# EAGLE design Adafruit 2.4in TFT FeatherWing (EAGLE 6.6.0)
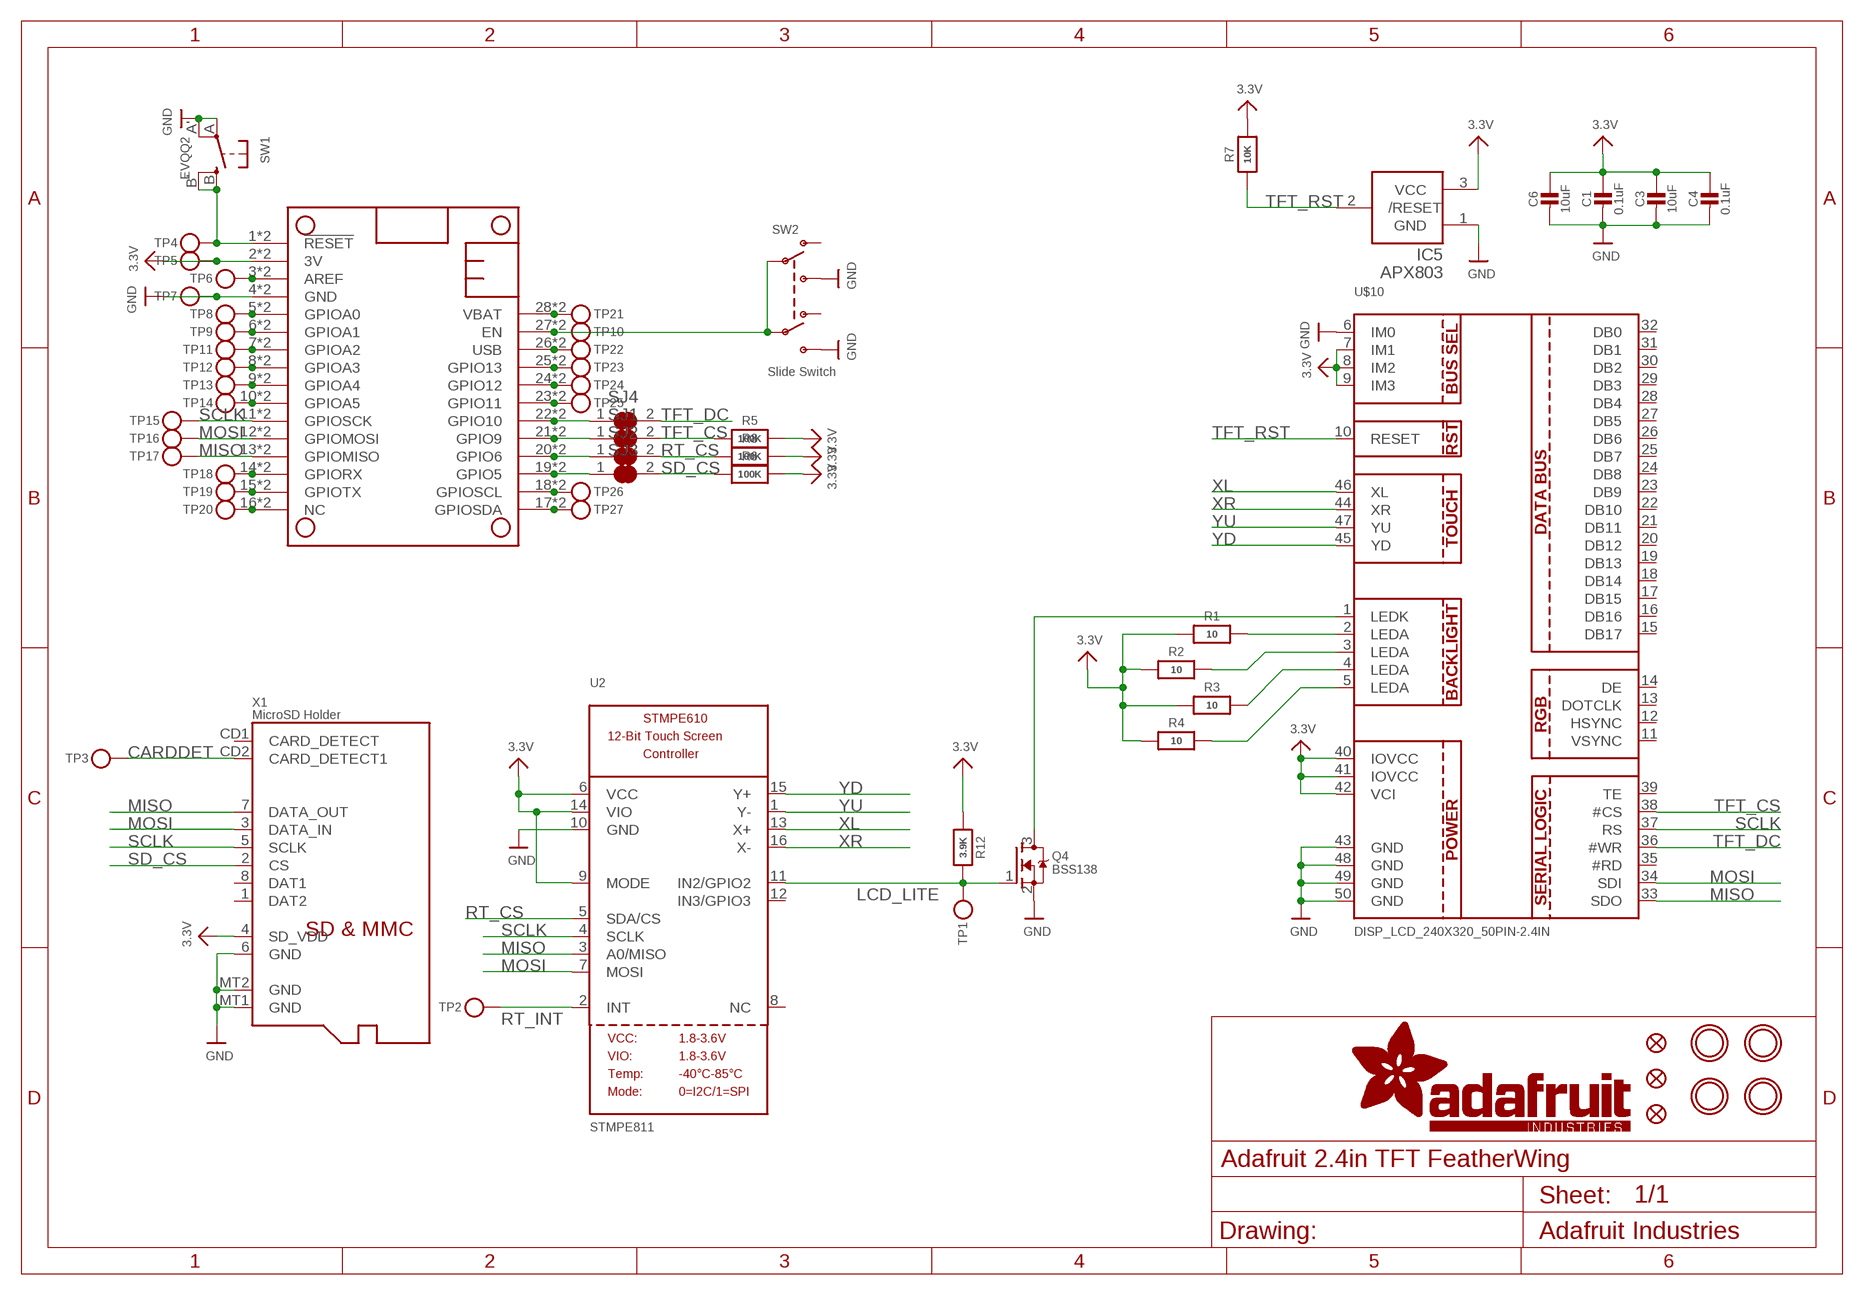
[diagram p0: schematic, sheet 1]

## Parts
C1  0.1uF  CAP_CERAMIC0805-NOOUTLINE  [0805-NO]
C3  10uF  CAP_CERAMIC0805-NOOUTLINE  [0805-NO]
C4  0.1uF  CAP_CERAMIC0805-NOOUTLINE  [0805-NO]
C6  10uF  CAP_CERAMIC0805-NOOUTLINE  [0805-NO]
FID1  FIDUCIAL""  [FIDUCIAL_1MM]
FID2  FIDUCIAL""  [FIDUCIAL_1MM]
FID3  FIDUCIAL""  [FIDUCIAL_1MM]
IC5  APX803  AXP083-SAG  [SOT23]
MS2  FEATHERWING_SMTDUAL  [FEATHERWING_SMT2]
Q4  BSS138  MOSFET-NWIDE  [SOT23-WIDE]
R1  10  RESISTOR0805_NOOUTLINE  [0805-NO]
R2  10  RESISTOR0805_NOOUTLINE  [0805-NO]
R3  10  RESISTOR0805_NOOUTLINE  [0805-NO]
R4  10  RESISTOR0805_NOOUTLINE  [0805-NO]
R5  100K  RESISTOR0805_NOOUTLINE  [0805-NO]
R6  100K  RESISTOR0805_NOOUTLINE  [0805-NO]
R7  10K  RESISTOR0805_NOOUTLINE  [0805-NO]
R8  100K  RESISTOR0805_NOOUTLINE  [0805-NO]
R12  3.9K  RESISTOR0805_NOOUTLINE  [0805-NO]
SJ1  SOLDERJUMPER_CLOSED  [SOLDERJUMPER_CLOSEDWIRE]
SJ2  SOLDERJUMPER_CLOSED  [SOLDERJUMPER_CLOSEDWIRE]
SJ3  SOLDERJUMPER_CLOSED  [SOLDERJUMPER_CLOSEDWIRE]
SJ4  SOLDERJUMPER_CLOSED  [SOLDERJUMPER_CLOSEDWIRE]
SW1  EVQQ2  SWITCH_TACT_SMT_EVQQ2_SMALL  [EVQ-Q2_SMALLER]
SW2  Slide Switch  SWITCH_DPDTEG1390  [EG1390]
TP1  TESTPOINTPAD2MM  [TESTPOINT_PAD_2MM]
TP2  TESTPOINTPAD2MM  [TESTPOINT_PAD_2MM]
TP3  TESTPOINTPAD2MM  [TESTPOINT_PAD_2MM]
TP4  TESTPOINTPAD2MM  [TESTPOINT_PAD_2MM]
TP5  TESTPOINTPAD2MM  [TESTPOINT_PAD_2MM]
TP6  TESTPOINTPAD2MM  [TESTPOINT_PAD_2MM]
TP7  TESTPOINTPAD2MM  [TESTPOINT_PAD_2MM]
TP8  TESTPOINTPAD2MM  [TESTPOINT_PAD_2MM]
TP9  TESTPOINTPAD2MM  [TESTPOINT_PAD_2MM]
TP10  TESTPOINTPAD2MM  [TESTPOINT_PAD_2MM]
TP11  TESTPOINTPAD2MM  [TESTPOINT_PAD_2MM]
TP12  TESTPOINTPAD2MM  [TESTPOINT_PAD_2MM]
TP13  TESTPOINTPAD2MM  [TESTPOINT_PAD_2MM]
TP14  TESTPOINTPAD2MM  [TESTPOINT_PAD_2MM]
TP15  TESTPOINTPAD2MM  [TESTPOINT_PAD_2MM]
TP16  TESTPOINTPAD2MM  [TESTPOINT_PAD_2MM]
TP17  TESTPOINTPAD2MM  [TESTPOINT_PAD_2MM]
TP18  TESTPOINTPAD2MM  [TESTPOINT_PAD_2MM]
TP19  TESTPOINTPAD2MM  [TESTPOINT_PAD_2MM]
TP20  TESTPOINTPAD2MM  [TESTPOINT_PAD_2MM]
TP21  TESTPOINTPAD2MM  [TESTPOINT_PAD_2MM]
TP22  TESTPOINTPAD2MM  [TESTPOINT_PAD_2MM]
TP23  TESTPOINTPAD2MM  [TESTPOINT_PAD_2MM]
TP24  TESTPOINTPAD2MM  [TESTPOINT_PAD_2MM]
TP25  TESTPOINTPAD2MM  [TESTPOINT_PAD_2MM]
TP26  TESTPOINTPAD2MM  [TESTPOINT_PAD_2MM]
TP27  TESTPOINTPAD2MM  [TESTPOINT_PAD_2MM]
U2  STMPE811  STMPE610  [QFN16_3MM]
U$9  MOUNTINGHOLE2.5  [MOUNTINGHOLE_2.5_PLATED]
U$10  DISP_LCD_240X320_50PIN-2.4IN  [TFT_2.4IN_240X320_50PIN]
U$11  MOUNTINGHOLE2.5  [MOUNTINGHOLE_2.5_PLATED]
U$15  MOUNTINGHOLE2.5  [MOUNTINGHOLE_2.5_PLATED]
U$17  MOUNTINGHOLE2.5  [MOUNTINGHOLE_2.5_PLATED]
X1  MicroSD Holder  MICROSD  [MICROSD]

## Nets
3.3V: C1.1 C3.1 C4.1 C6.1 IC5.3(VCC) MS2.2'(3V) MS2.2(3V) R1.1 R2.1 R3.1 R4.1 R5.2 R6.2 R7.2 R8.2 R12.1 TP5.P$1 U2.6(VCC) U2.9(MODE) U2.14(VIO) U$10.7(IM1) U$10.8(IM2) U$10.9(IM3) U$10.40(IOVCC) U$10.41(IOVCC) U$10.42(VCI) X1.4(SD_VDD)
!RESET: MS2.1'(!RESET) MS2.1(!RESET) SW1.B'(S1) SW1.B(S) TP4.P$1
A: MS2.5'(GPIOA0) MS2.5(GPIOA0) TP8.P$1
AREF: MS2.3'(AREF) MS2.3(AREF) TP6.P$1
B: MS2.6'(GPIOA1) MS2.6(GPIOA1) TP9.P$1
C: MS2.7'(GPIOA2) MS2.7(GPIOA2) TP11.P$1
CARDDET: TP3.P$1 X1.CD2(CARD_DETECT1)
D: MS2.8'(GPIOA3) MS2.8(GPIOA3) TP12.P$1
E: MS2.9'(GPIOA4) MS2.9(GPIOA4) TP13.P$1
EN: MS2.27'(EN) MS2.27(EN) SW2.P1 SW2.P2 TP10.P$1
F: MS2.10'(GPIOA5) MS2.10(GPIOA5) TP14.P$1
G: MS2.16'(NC) MS2.16(NC) TP20.P$1
GND: C1.2 C3.2 C4.2 C6.2 IC5.1(GND) MS2.4'(GND) MS2.4(GND) Q4.2(S) SW1.A'(P1) SW1.A(P) SW2.S1 SW2.S2 TP7.P$1 U2.10(GND) U$10.6(IM0) U$10.43(GND) U$10.48(GND) U$10.49(GND) U$10.50(GND) X1.6(GND) X1.MT1(GND) X1.MT2(GND)
H: MS2.19'(GPIO5) MS2.19(GPIO5) SJ3.1
I: MS2.20'(GPIO6) MS2.20(GPIO6) SJ2.1
J: MS2.21'(GPIO9) MS2.21(GPIO9) SJ1.1
K: MS2.22'(GPIO10) MS2.22(GPIO10) SJ4.1
L: MS2.23'(GPIO11) MS2.23(GPIO11) TP25.P$1
LCD_LITE: Q4.1(G) R12.2 TP1.P$1 U2.11(IN2/GPIO2)
M: MS2.24'(GPIO12) MS2.24(GPIO12) TP24.P$1
MISO: MS2.13'(GPIOMISO) MS2.13(GPIOMISO) TP17.P$1 U2.3(A0/MISO) U$10.33(SDO) X1.7(DATA_OUT)
MOSI: MS2.12'(GPIOMOSI) MS2.12(GPIOMOSI) TP16.P$1 U2.7(MOSI) U$10.34(SDI) X1.3(DATA_IN)
N: MS2.25'(GPIO13) MS2.25(GPIO13) TP23.P$1
N$1: R4.2 U$10.5(LEDA)
N$2: R1.2 U$10.2(LEDA)
N$3: R2.2 U$10.3(LEDA)
N$4: R3.2 U$10.4(LEDA)
N$5: Q4.3(D) U$10.1(LEDK)
RT_CS: R8.1 SJ2.2 U2.5(SDA/CS)
RT_INT: TP2.P$1 U2.2(INT)
RX: MS2.14'(GPIORX) MS2.14(GPIORX) TP18.P$1
SCL: MS2.18'(GPIOSCL) MS2.18(GPIOSCL) TP26.P$1
SCLK: MS2.11'(GPIOSCK) MS2.11(GPIOSCK) TP15.P$1 U2.4(SCLK) U$10.37(RS) X1.5(SCLK)
SD_CS: R6.1 SJ3.2 X1.2(CS)
SDA: MS2.17'(GPIOSDA) MS2.17(GPIOSDA) TP27.P$1
TFT_CS: R5.1 SJ1.2 U$10.38(#CS)
TFT_DC: SJ4.2 U$10.36(#WR)
TFT_RST: IC5.2(/RESET) R7.1 U$10.10(RESET)
TX: MS2.15'(GPIOTX) MS2.15(GPIOTX) TP19.P$1
USB: MS2.26'(USB) MS2.26(USB) TP22.P$1
VBAT: MS2.28'(VBAT) MS2.28(VBAT) TP21.P$1
XL: U2.13(X+) U$10.46(XL)
XR: U2.16(X-) U$10.44(XR)
YD: U2.15(Y+) U$10.45(YD)
YU: U2.1(Y-) U$10.47(YU)
Unconnected: SW2.O1 SW2.O2 U2.8(NC) U2.12(IN3/GPIO3) U$10.11(VSYNC) U$10.12(HSYNC) U$10.13(DOTCLK) U$10.14(DE) U$10.15(DB17) U$10.16(DB16) U$10.17(DB15) U$10.18(DB14) U$10.19(DB13) U$10.20(DB12) U$10.21(DB11) U$10.22(DB10) U$10.23(DB9) U$10.24(DB8) U$10.25(DB7) U$10.26(DB6) U$10.27(DB5) U$10.28(DB4) U$10.29(DB3) U$10.30(DB2) U$10.31(DB1) U$10.32(DB0) U$10.35(#RD) U$10.39(TE) X1.1(DAT2) X1.8(DAT1) X1.CD1(CARD_DETECT)

## Library data of the parts
C1 C3 C4 C6 = microbuilder:CAP_CERAMIC: Ceramic Capacitors For new designs, use the packages preceded by an '_' character since they are more reliable: The following footprints should be used on most boards: _0402 - Standard footprint for regular board layouts _0603 - Standard footprint for regular board layouts _0805 - Standard footprint for regular board layouts _1206 - Standard footprint for regular board layouts For extremely tight-pitch boards where space is at a premium, the following 'micro-pitch' footprints can be used (smaller pads, no silkscreen outline, etc.): _0402MP - Micro-pitch footprint for very dense/compact boards _0603MP - Micro-pitch footprint for very dense/compact boards _0805MP - Micro-pitch footprint for very dense/compact boards _1206MP - Micro-pitch footprint for very dense/compact boards
FID1-FID3 = microbuilder:FIDUCIAL: Fiducial Alignment Points Various fiducial points for machine vision alignment.; BOM: EXCLUDE
IC5 = adafruit:AXP083
MS2 = microbuilder:FEATHERWING
Q4 = microbuilder:MOSFET-N: N-Channel Mosfet LEGEND VDS: Voltage Drain-Source ID: Drain Current RDS(ON): Drain-Source On-State Resistance VGS(TH): Gate-Source Threshold Voltage CISS: Drain-Source Input Capacitance SOT-23 Name VDS ID RDS(ON) VGS(TH) CISS Order Number 2N7002E 60V 260mA 2.5 Ohm 2.5V @ 250uA 26.7pF @ 25V 2N7002ET1GOSTR-ND BSH103 30V 850mA 400 mOhm 400mV @ 1mA 83pF @ 24V BSH103,235-ND BSS138 60V 320mA 1.6 Ohm 1.5V @ 250uA 50pF @ 10V Mouser: 771-BSS138PW115 DMN2075U-7 20V 4.2A 38 mOhm 1V @ 250 uA 594.3pF @ 10V DMN2075U-7DICT-ND * BSS138 good choice for I2C level-shifting POWERPAK 1212-8 Name VDS ID RDS(ON) VGS(TH) CISS Order Number Si7308DN 60V 6A 58 mOhm 3V @ 250uA 665pF @ 15V SI7308DN-T1-E3CT-ND
R1-R8 R12 = microbuilder:RESISTOR: Resistors For new designs, use the packages preceded by an '_' character since they are more reliable: The following footprints should be used on most boards: _0402 - Standard footprint for regular board layouts _0603 - Standard footprint for regular board layouts _0805 - Standard footprint for regular board layouts _1206 - Standard footprint for regular board layouts For extremely tight-pitch boards where space is at a premium, the following 'micro-pitch' footprints can be used (smaller pads, no silkscreen outline, etc.): _0402MP - Micro-pitch footprint for very dense/compact boards _0603MP - Micro-pitch footprint for very dense/compact boards _0805MP - Micro-pitch footprint for very dense/compact boards _1206MP - Micro-pitch footprint for very dense/compact boards
SJ1-SJ4 = microbuilder:SOLDERJUMPER_CLOSED: Solder Jumper - Closed These solder jumpers are closed by default CLOSEDWIRE - 10 mil trace between pads that can be cut and resoldered later CLOSEDPERM - 63 mil trace between pads for a permanent connection (used to 'bridge' two signals, a shameless hack for Eagle). Can double as a test point as well (no cream layer)
SW1 = microbuilder:SWITCH_TACT_SMT: SMT Tact Switches 6x6mm - Digikey: P12940SCT-ND KMR2 (4.6x2.8mm) - Digikey: 401-1426-1-ND EVQ-PQHB55 - Light Touch, 160GF (4.5x4.5mm) - Digikey: P8090SCT-ND KMT0 - KMT021 NGJ LHS (etc.) IP68/Waterproof - Digikey: CKN10289CT-ND
SW2 = microbuilder:SWITCH_DPDT: Switch - DPDT A DPDT Switch acts like an SPDT switch, but has a pair of switches instead of just one. Vertical - 0.3A @ 6V SMT - Digikey: JS202011SCQN
TP1-TP27 = microbuilder:TESTPOINT: Test Point Various test points for characterisation and PCB testing TESTPOINT_SMT - Compact Surface Mount Test Point [Digikey: 5016KTR-ND]
U2 = microbuilder:STMPE610: STMPE610 - 12-Bit Touch Screen Controller
U$9 U$11 U$15 U$17 = microbuilder:MOUNTINGHOLE: Mounting Hole For #2 screws (0.086"/2.18mm width, 0.094"/2.4mm hole) use 2.5mm; BOM: EXCLUDE
U$10 = microbuilder:DISP_LCD_240X320_50PIN
X1 = microbuilder:MICROSD: MicroSD/Transflash Card Holder with SPI pinout 3M: 2908-05WB-MG 4UConnector: 19656 Footprint courtesy: Adafruit Industries

## Board
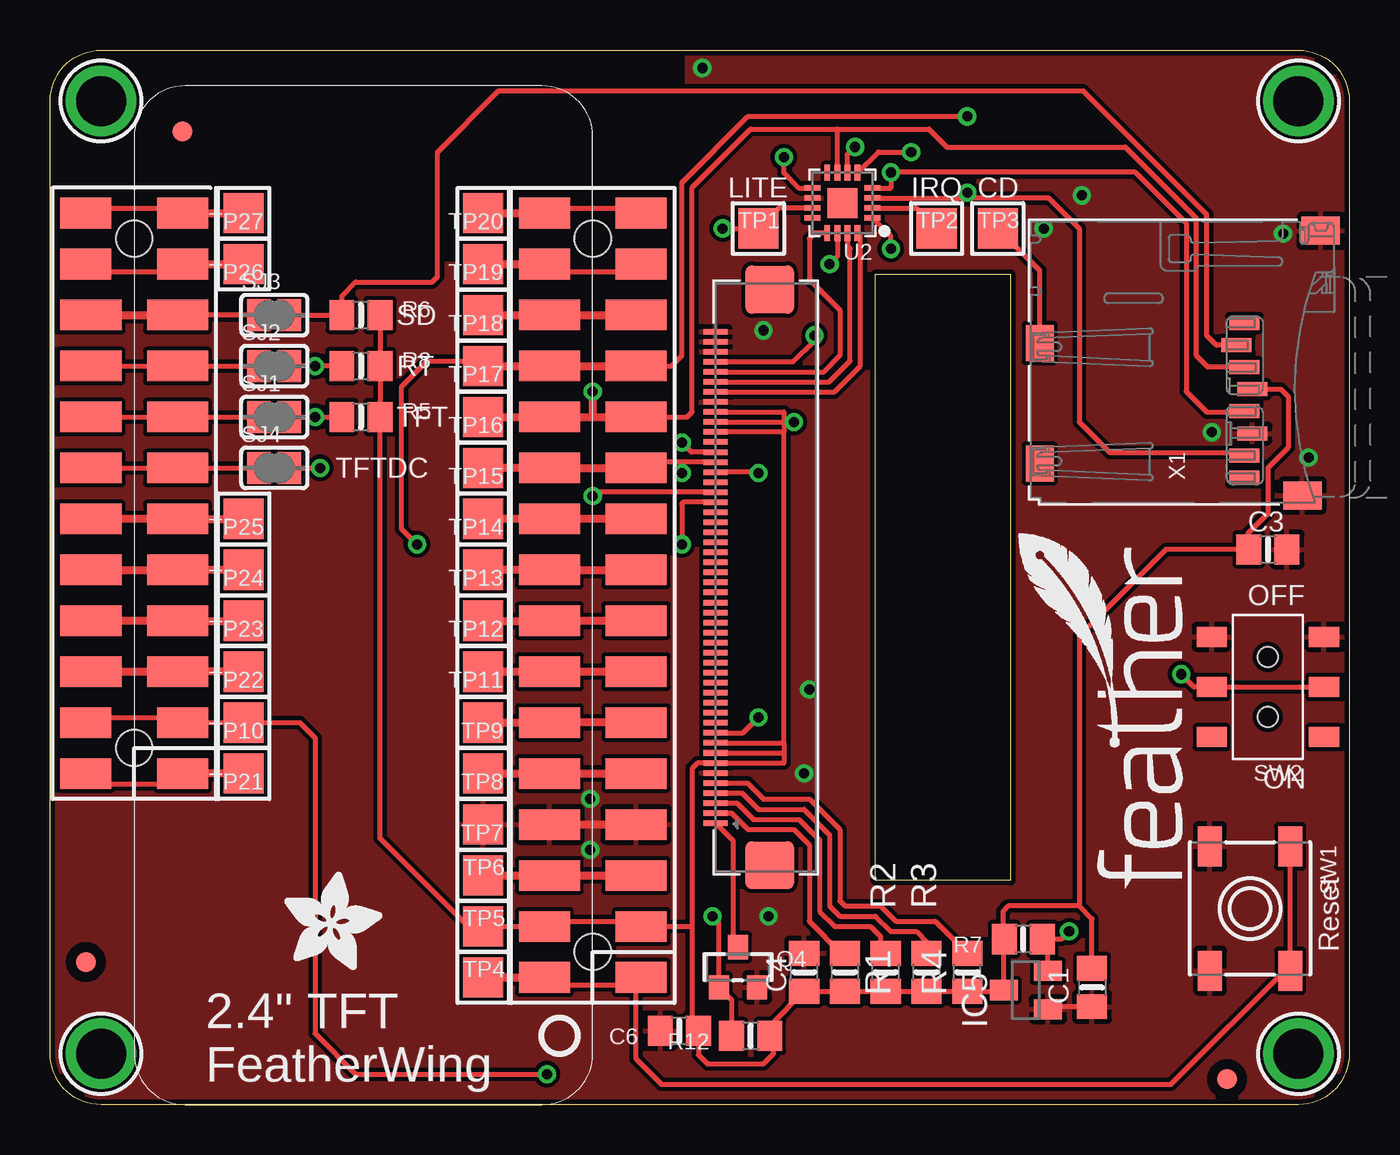
[diagram p1: board, top side]
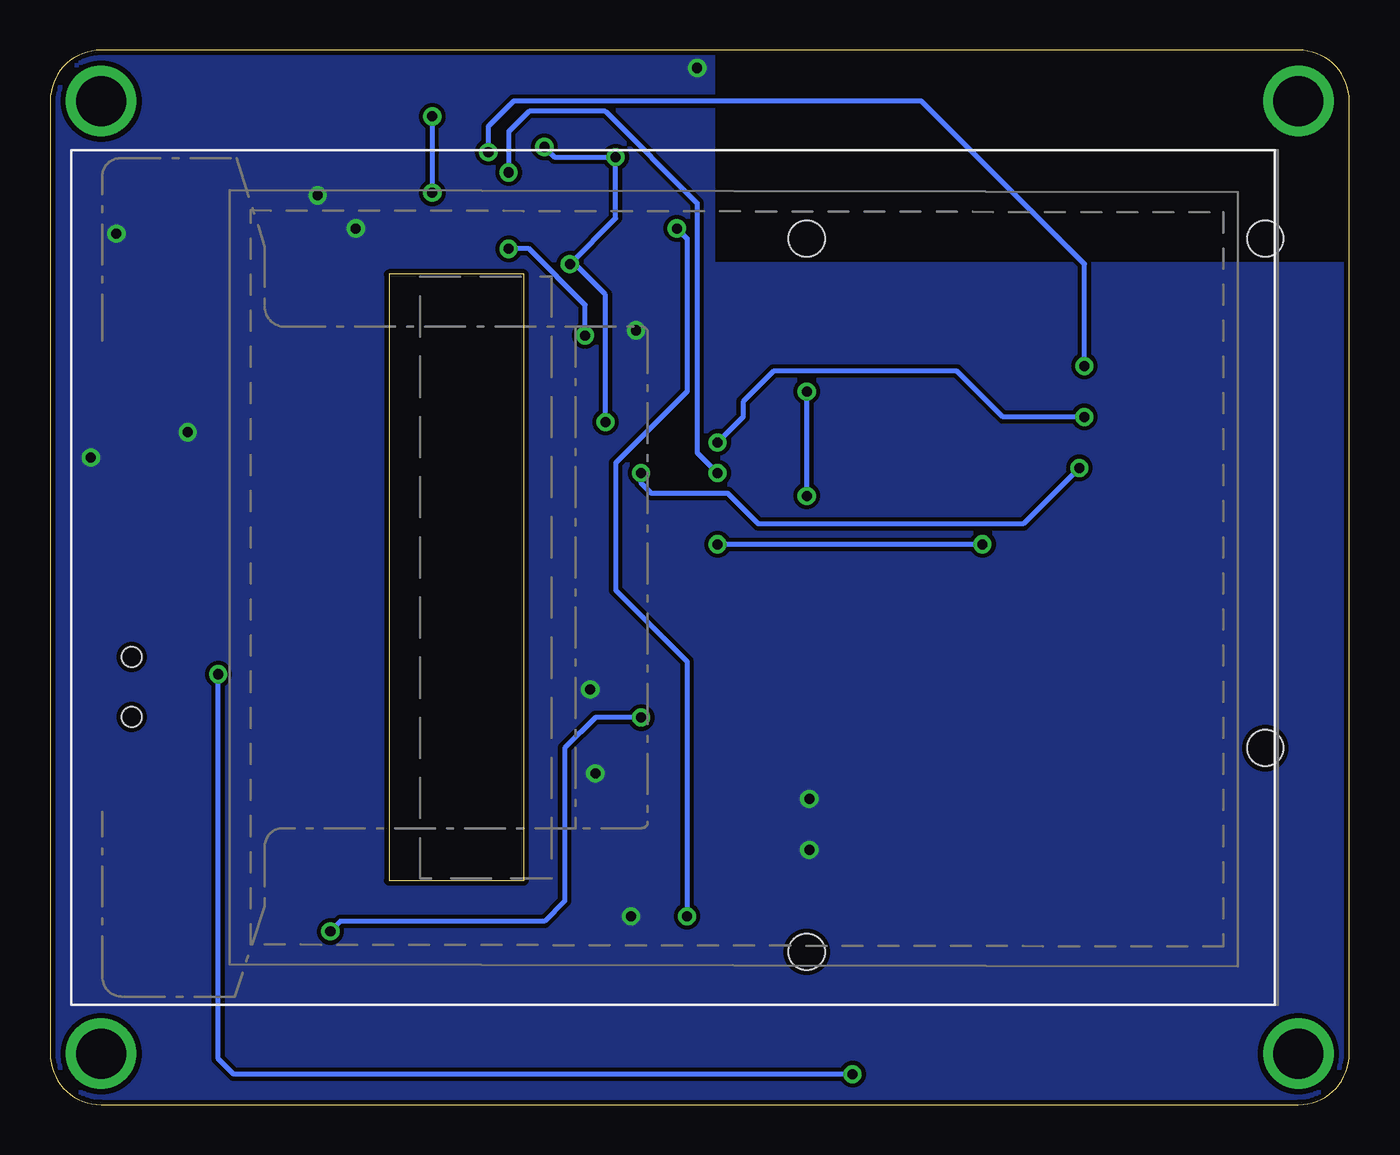
[diagram p2: board, bottom side, seen from below]

Size 64.77 x 52.58 mm. Coordinates in mm from the lower left corner, seen from the top.
Outline: 0,2.54 0,50.04 arc-90 2.54,52.58 62.23,52.58 arc-90 64.77,50.04 64.77,2.54 arc-90 62.23,0 2.54,0 arc-90 0,2.54
Outline: 41.15,11.18 41.15,41.4 47.88,41.4 47.88,11.18 41.15,11.18
Copper layers (1*16): Top 0.035mm / dielectric 1.5mm / Bottom 0.035mm
Design rules "adafruit *": minimum track width 8mil, minimum drill 15.5mil, track to track 8mil, track to pad 8mil, pad to pad 8mil, via to via 8mil, smd to smd 8mil, copper to edge 10mil, drill to drill 8mil, minimum pad ring 10mil, minimum via ring 8mil, stop-mask expansion 2mil, vias tented up to drill 20mil, thermal gap 10mil

### Footprints (pad centres in the part's own frame; a part is rotated, then mirrored left to right if it is on the bottom)
0805-NO = smd 1.24 x 1.5: 1 -0.95,0; 2 0.95,0
FIDUCIAL_1MM = smd 1 x 1: 1 0,0
SOT23 = smd 1 x 1.4: 1 -0.95,-1.1; 2 0.95,-1.1; 3 0,1.1
FEATHERWING_SMT2 = smd 1.524 x 2.54: 1 6.35,2.413; 1' 6.35,-2.413; 2 8.89,2.413; 2' 8.89,-2.413; 15 41.91,2.413; 15' 41.91,-2.413; 16 44.45,2.413; 16' 44.45,-2.413; 17 44.45,20.447; 17' 44.45,25.273; 18 41.91,20.447; 18' 41.91,25.273; 27 19.05,20.447; 27' 19.05,25.273; 28 16.51,20.447; 28' 16.51,25.273 | smd 1.524 x 3.048: 3 11.43,2.159; 3' 11.43,-2.159; 4 13.97,2.159; 4' 13.97,-2.159; 5 16.51,2.159; 5' 16.51,-2.159; 6 19.05,2.159; 6' 19.05,-2.159; 7 21.59,2.159; 7' 21.59,-2.159; 8 24.13,2.159; 8' 24.13,-2.159; 9 26.67,2.159; 9' 26.67,-2.159; 10 29.21,2.159; 10' 29.21,-2.159; 11 31.75,2.159; 11' 31.75,-2.159; 12 34.29,2.159; 12' 34.29,-2.159; 13 36.83,2.159; 13' 36.83,-2.159; 14 39.37,2.159; 14' 39.37,-2.159; 19 39.37,20.701; 19' 39.37,25.019; 20 36.83,20.701; 20' 36.83,25.019; 21 34.29,20.701; 21' 34.29,25.019; 22 31.75,20.701; 22' 31.75,25.019; 23 29.21,20.701; 23' 29.21,25.019; 24 26.67,20.701; 24' 26.67,25.019; 25 24.13,20.701; 25' 24.13,25.019; 26 21.59,20.701; 26' 21.59,25.019 | hole 1.8: 17.78,22.86; 43.18,22.86; 7.62,0; 43.18,0
SOT23-WIDE = smd 1 x 1.2: 1 -0.95,-1; 2 0.95,-1; 3 0,1
SOLDERJUMPER_CLOSEDWIRE = smd 1.168 x 1.6: 1 -0.762,0; 2 0.762,0 | smd 0.635 x 0.203: WIRE 0,0
EVQ-Q2_SMALLER = smd 2 x 1.2: A -3.1,-2; A' 3.1,-2; B -3.1,2; B' 3.1,2
EG1390 = smd 1 x 1.5: O1 -2.5,2.8; O2 -2.5,-2.8; P1 0,2.8; P2 0,-2.8; S1 2.5,2.8; S2 2.5,-2.8 | hole 1: 1.5,0; -1.5,0
TESTPOINT_PAD_2MM = smd 2 x 2: P$1 0,0
QFN16_3MM = smd 0.8 x 0.28: 1 -1.5,0.75; 2 -1.5,0.25; 3 -1.5,-0.25; 4 -1.5,-0.75; 9 1.5,-0.75; 10 1.5,-0.25; 11 1.5,0.25; 12 1.5,0.75 | smd 0.28 x 0.8: 5 -0.75,-1.5; 6 -0.25,-1.5; 7 0.25,-1.5; 8 0.75,-1.5; 13 0.75,1.5; 14 0.25,1.5; 15 -0.25,1.5; 16 -0.75,1.5 | smd 1.5 x 1.5: THERMAL 0,0
MOUNTINGHOLE_2.5_PLATED = drill 2.5 pad 3.2: P$1 0,0
TFT_2.4IN_240X320_50PIN = smd 0.275 x 1.2 bottom: 1 12.25,28.551; 2 11.75,28.551; 3 11.25,28.551; 4 10.75,28.551; 5 10.25,28.551; 6 9.75,28.551; 7 9.25,28.551; 8 8.75,28.551; 9 8.25,28.551; 10 7.75,28.551; 11 7.25,28.551; 12 6.75,28.551; 13 6.25,28.551; 14 5.75,28.551; 15 5.25,28.551; 16 4.75,28.551; 17 4.25,28.551; 18 3.75,28.551; 19 3.25,28.551; 20 2.75,28.551; 21 2.25,28.551; 22 1.75,28.551; 23 1.25,28.551; 24 0.75,28.551; 25 0.25,28.551; 26 -0.25,28.551; 27 -0.75,28.551; 28 -1.25,28.551; 29 -1.75,28.551; 30 -2.25,28.551; 31 -2.75,28.551; 32 -3.25,28.551; 33 -3.75,28.551; 34 -4.25,28.551; 35 -4.75,28.551; 36 -5.25,28.551; 37 -5.75,28.551; 38 -6.25,28.551; 39 -6.75,28.551; 40 -7.25,28.551; 41 -7.75,28.551; 42 -8.25,28.551; 43 -8.75,28.551; 44 -9.25,28.551; 45 -9.75,28.551; 46 -10.25,28.551; 47 -10.75,28.551; 48 -11.25,28.551; 49 -11.75,28.551; 50 -12.25,28.551 | smd 2.4 x 2.4 bottom: PAD1 14.35,25.851; PAD2 -14.35,25.851
MICROSD = smd 0.7 x 1.5: 1 9,-10.64; 2 7.9,-10.24; 3 6.8,-10.64; 4 5.7,-11.04; 5 4.6,-10.64; 6 3.5,-11.04; 7 2.4,-10.64; 8 1.3,-10.64 | smd 1.8 x 1.4: CD1 2,-0.44; CD2 8,-0.44 | smd 1.4 x 1.9: MT1 0.4,-13.54; MT2 13.6,-14.44

### Placement (x,y rotation side)
C1  51.94,5.84 270 top
C3  60.71,27.69 0 top
C4  37.59,6.6 90 top
C6  31.37,3.68 180 top
FID1  6.6,48.51 0 top
FID2  58.67,1.27 0 top
FID3  1.78,7.11 0 top
IC5  48.64,5.71 90 top
MS2  27.05,0 90 top
Q4  34.29,6.86 0 top
R1  39.62,6.6 90 top
R2  41.66,6.6 90 top
R3  43.69,6.6 90 top
R4  45.72,6.6 90 top
R5  15.49,34.29 0 top
R6  15.49,39.37 0 top
R7  48.51,8.26 180 top
R8  15.49,36.83 0 top
R12  34.92,3.43 180 top
SJ1  11.18,34.29 0 top
SJ2  11.18,36.83 0 top
SJ3  11.18,39.37 0 top
SJ4  11.18,31.75 0 top
SW1  59.82,9.78 270 top
SW2  60.71,20.83 90 top
TP1  35.31,43.69 0 top
TP2  44.2,43.69 0 top
TP3  47.24,43.69 0 top
TP4  21.59,6.35 0 top
TP5  21.59,8.89 0 top
TP6  21.59,11.43 0 top
TP7  21.59,13.97 180 top
TP8  21.59,16.51 180 top
TP9  21.59,19.05 180 top
TP10  9.65,19.05 180 top
TP11  21.59,21.59 180 top
TP12  21.59,24.13 180 top
TP13  21.59,26.67 180 top
TP14  21.59,29.21 180 top
TP15  21.59,31.75 180 top
TP16  21.59,34.29 180 top
TP17  21.59,36.83 180 top
TP18  21.59,39.37 180 top
TP19  21.59,41.91 180 top
TP20  21.59,44.45 180 top
TP21  9.65,16.51 180 top
TP22  9.65,21.59 180 top
TP23  9.65,24.13 180 top
TP24  9.65,26.67 180 top
TP25  9.65,29.21 180 top
TP26  9.65,41.91 180 top
TP27  9.65,44.45 180 top
U2  39.5,44.96 180 top
U$9  2.54,2.54 0 top
U$10  61.72,26.29 270 bottom
U$11  2.54,50.04 0 top
U$15  62.23,2.54 0 top
U$17  62.23,50.04 0 top
U$29  [FEATHERLOGO_MED]  56.52,10.67 90 top
U$30  [ADAFRUIT_5MM]  11.68,6.73 0 top
U$34  [PCBFEAT-REV-040]  25.4,3.43 0 top
X1  48.9,29.97 90 top

### Tracks (layer width: path | path; a pad name or v marks a point on that pad's centre or on a via)
3.3V  (via drill 0.5)
  Top 0.254: C1.1 51.94,9.27 51.31,9.91 | 51.31,9.91 47.75,9.91 47.5,9.65 47.5,8.32 R7.2 47.54,8.23 IC5.3 47.48,5.65 R4.1 R3.1 R2.1 R1.1 C4.1 35.88,3.94 R12.1 | 32,8.89 MS2.2' 28.83,8.89 28.57,9.14 24.89,9.14 MS2.2 TP5.P$1 | U$10.41 36.58,34.04 | 36.58,34.04 | 36.58,34.04 36.58,33.53 | 36.58,33.53 33.17,33.53 U$10.40 | U$10.42 36.58,34.54 36.58,34.04 | U$10.9 36.58,18.04 | 36.58,18.04 36.58,17.54 | 36.58,17.54 36.58,17.04 U$10.7 32.28,17.04 32,16.76 32,8.89 | U$10.8 36.58,17.54 | 36.58,18.04 36.58,33.53 | R6.2 R8.2 R5.2 16.44,13.27 20.83,8.89 21.08,8.89 | U2.14 39.25,42.3 v38.86,41.91 | U2.9 37.33,45.71 36.58,46.46 v36.58,47.24 | 36.58,34.04 v37.08,34.04 | 51.31,9.91 51.31,23.37 55.63,27.69 C3.1 59.69,27.75 59.69,28.45 60.71,29.46 60.71,31.75 61.72,32.77 61.72,35.31 61.36,35.67 X1.4 | U2.6 39.75,47.37 v40.13,47.75 | 35.56,3.24 35.75,3.43 R12.1 | 32,8.89 32,4 C6.1 32.32,2.48 32.77,2.03 35.56,2.03 36.07,2.54 36.07,3.24 R12.1
  Top 0.406: TP5.P$1 21.08,8.89
  Bottom 0.254: v37.08,34.04 37.08,40.39 38.61,41.91 v38.86,41.91 36.58,44.2 v36.58,47.24 39.62,47.24 v40.13,47.75
!RESET
  Top 0.254: SW1.B SW1.B' 61.82,6.95 55.88,1.02 30.48,1.02 29.21,2.29 29.21,6.1 MS2.1' 28.83,6.35 28.45,5.97 25.02,5.97 MS2.1
  Top 0.406: TP4.P$1 MS2.1
A
  Top 0.406: MS2.5' MS2.5 TP8.P$1
AREF
  Top 0.406: MS2.3' MS2.3 TP6.P$1
B
  Top 0.406: MS2.6' 25.78,19.05 25.78,18.92 24.89,18.92 MS2.6 TP9.P$1
C
  Top 0.406: MS2.7' 29.21,21.34 28.7,21.34 28.7,21.59 MS2.7 TP11.P$1
CARDDET
  Top 0.254: X1.CD2 49.34,41.6 TP3.P$1
D
  Top 0.406: MS2.8' MS2.8 TP12.P$1
E
  Top 0.406: MS2.9' 29.21,26.16 28.45,26.16 28.45,26.67 MS2.9 TP13.P$1
EN  (via drill 0.5)
  Top 0.254: SW2.P2 SW2.P1 57.02,20.83 v56.39,21.46 | TP10.P$1 MS2.27 6.1,19.05 5.84,19.3 2.03,19.3 MS2.27' | 9.91,19.05 12.45,19.05 13.21,18.29 13.21,3.56 15.24,1.52 v24.77,1.52
  Top 0.406: TP10.P$1 9.91,19.05
  Bottom 0.254: v24.77,1.52 55.63,1.52 56.39,2.29 v56.39,21.46
F
  Top 0.406: MS2.10' MS2.10 TP14.P$1
G
  Top 0.254: MS2.16 24.89,44.7 28.83,44.7 29.08,44.45 MS2.16'
  Top 0.406: TP20.P$1 MS2.16
GND  (via drill 0.5)
  Top 0.254: C1.2 49.87,4.89 IC5.1
  Top 0.406: MS2.4 MS2.4'
  other vias: 35.81,9.4 37.59,16.51 35.56,38.61 26.92,15.24 26.92,12.7 57.91,33.53 62.74,32.26 61.47,43.43 37.85,20.7 32.51,51.69 51.44,45.34 49.53,43.69
  pour Top: 0.13,41.91 0,0 64.77,0 64.77,52.58 31.75,52.58 31.75,41.91
  pour Bottom: 0,41.91 0,0 64.77,0 64.77,52.58 31.75,52.58 31.75,41.91
H
  Top 0.254: SJ3.1 MS2.19
  Top 0.406: MS2.19' MS2.19
I
  Top 0.254: MS2.20' MS2.20 SJ2.1
J
  Top 0.254: MS2.21' MS2.21 SJ1.1
K
  Top 0.254: MS2.22' MS2.22 SJ4.1
L
  Top 0.406: MS2.23' MS2.23 TP25.P$1
LCD_LITE  (via drill 0.5)
  Top 0.254: v33.02,9.4 33.34,9.08 Q4.1 33.98,5.22 R12.2 | U2.11 36.33,44.71 TP1.P$1 v33.53,43.69
  Bottom 0.254: v33.53,43.69 33.02,43.18 33.02,35.56 36.58,32 36.58,25.65 33.02,22.1 v33.02,9.4
M
  Top 0.406: MS2.24' MS2.24 TP24.P$1
MISO  (via drill 0.5)
  Top 0.254: U2.3 45.72,45.21 | X1.7 59.4,32.51 52.83,32.51 51.31,34.04 51.31,43.69 49.79,45.21 45.72,45.21 | U$10.33 31.56,30.04 31.5,29.97 v31.5,27.94 | MS2.13' 30.99,36.83 31.5,37.34 31.5,45.97 34.8,49.28 v45.72,49.28 | v45.72,45.47 45.72,45.21 | 20.83,36.83 TP17.P$1 | v18.29,27.94 17.53,28.7 17.53,35.81 18.8,37.08 21.84,37.08 22.1,36.83
  Top 0.406: MS2.13' MS2.13 22.1,36.83 TP17.P$1
  Bottom 0.254: v45.72,49.28 v45.72,45.47 | v18.29,27.94 v31.5,27.94
MOSI  (via drill 0.5)
  Top 0.254: X1.3 57.72,36.77 57.15,37.34 57.15,44.2 53.59,47.75 44.7,47.75 43.81,48.64 39.25,48.64 | 22.86,34.29 MS2.12 | MS2.12' 31.75,34.29 32,34.54 32,45.72 34.92,48.64 39.25,48.64 | U2.7 39.25,48.64 | 20.83,34.29 TP16.P$1 | 27.18,30.48 v27.05,30.35 27.24,30.54 U$10.34
  Top 0.406: 27.05,34.29 MS2.12 TP16.P$1 | v27.05,35.56 27.05,34.29 | 27.05,34.29 MS2.12'
  Bottom 0.254: v27.05,30.35 v27.05,35.56
N
  Top 0.406: MS2.25' MS2.25 TP23.P$1
N$1
  Top 0.254: U$10.5 34.76,16.04 35.56,15.24 37.85,15.24 39.37,13.72 39.37,10.16 39.62,9.91 41.4,9.91 42.16,9.14 44.13,9.14 R4.2
N$2
  Top 0.254: U$10.2 33.98,14.54 34.8,13.72 37.08,13.72 37.85,12.95 37.85,9.14 39.44,7.55 R1.2
N$3
  Top 0.254: U$10.3 34.24,15.04 35.05,14.22 37.34,14.22 38.35,13.21 38.35,9.65 39.12,8.89 40.89,8.89 41.4,8.38 41.4,7.81 R2.2
N$4
  Top 0.254: U$10.4 34.5,15.54 35.31,14.73 37.59,14.73 38.86,13.46 38.86,9.91 39.37,9.4 41.15,9.4 41.91,8.64 43.18,8.64 43.69,8.13 R3.2
N$5
  Top 0.254: U$10.1 34.04,13.17 34.04,8.38 34.29,8.13 Q4.3
RT_CS  (via drill 0.5)
  Top 0.254: R8.1 v13.21,36.83 SJ2.2 | U2.5 41.29,47.5 v42.93,47.5
  Bottom 0.254: v13.21,36.83 13.21,41.91 21.34,50.04 41.66,50.04 42.93,48.77 v42.93,47.5
RT_INT
  Top 0.254: U2.2 43.18,44.71 TP2.P$1
RX
  Top 0.406: MS2.14' MS2.14 TP18.P$1
SCL
  Top 0.254: MS2.18' 2.16,41.53 5.84,41.53 6.22,41.91 MS2.18
  Top 0.406: MS2.18 TP26.P$1
SCLK  (via drill 0.5)
  Top 0.254: U$10.37 31.49,32.04 | 31.49,32.04 29.5,32.04 MS2.11' | U2.4 41.91,45.71 v41.91,46.48 54.1,46.48 56.64,43.94 56.64,35.56 57.66,34.54 59.51,34.54 X1.5 | 31.49,32.04 v31.49,31.5 v31.5,31.5
  Top 0.406: MS2.11' MS2.11 TP15.P$1
  Bottom 0.254: v41.91,46.48 41.91,48.51 40.89,49.53 37.08,49.53 32.51,44.96 32.51,32.51 v31.5,31.5
SD_CS
  Top 0.254: X1.2 58.14,37.87 57.66,38.35 57.66,44.38 51.5,50.55 22.35,50.55 19.3,47.5 19.3,41.27 19.05,41.02 15.24,41.02 14.54,40.33 R6.1 SJ3.2
SDA
  Top 0.254: MS2.17' 2.03,44.7 5.71,44.7 5.97,44.45 MS2.17
  Top 0.406: MS2.17 TP27.P$1
TFT_CS  (via drill 0.5)
  Top 0.254: SJ1.2 v13.21,34.29 R5.1 | U$10.38 31.98,32.54 v31.5,33.02
  Bottom 0.254: v13.21,34.29 17.27,34.29 19.56,36.58 28.7,36.58 30.23,35.05 30.23,34.29 v31.5,33.02
TFT_DC  (via drill 0.5)
  Top 0.254: SJ4.2 v13.46,31.75 | v35.31,31.5 35.26,31.54 U$10.36
  Bottom 0.254: v35.31,31.5 35.31,30.99 34.8,30.48 30.99,30.48 29.46,28.96 16.26,28.96 v13.46,31.75
TFT_RST  (via drill 0.5)
  Top 0.254: IC5.2 49.74,7.98 R7.1 50.42,8.26 v50.8,8.64 | U$10.10 34.54,18.54 v35.31,19.3
  Bottom 0.254: v35.31,19.3 37.59,19.3 39.12,17.78 39.12,10.16 40.13,9.14 50.29,9.14 v50.8,8.64
TX
  Top 0.254: MS2.15 25.02,41.53 28.57,41.53 28.96,41.91 MS2.15'
  Top 0.406: TP19.P$1 MS2.15
USB
  Top 0.406: MS2.26' 5.84,21.59 MS2.26 TP22.P$1
VBAT
  Top 0.254: MS2.28' 2.29,16 6.1,16 MS2.28
  Top 0.406: TP21.P$1 MS2.28
XL
  Top 0.254: U$10.46 38.57,36.54 39.37,37.34 39.37,39.62 37.85,41.15 37.85,43.18 38.12,43.46 U2.13
XR
  Top 0.254: U$10.44 39.09,35.54 40.39,36.83 40.39,43.32 U2.16
YD
  Top 0.254: U$10.45 38.83,36.04 39.88,37.08 39.88,42.67 39.75,42.8 U2.15
YU  (via drill 0.5)
  Top 0.254: U$10.47 37.04,37.04 38.1,38.1 v38.1,38.35 | v41.91,42.67 41.91,43.3 U2.1
  Bottom 0.254: v38.1,38.35 38.1,39.88 40.89,42.67 v41.91,42.67

### Text on the board
tPlace: LITE | IRQ | CD | SD | RT | TFT | TFTDC | OFF | ON | Reset | 2.4" TFT / FeatherWing